# Altium schematic sheet Sheet_CL-PFC-01.SchDoc: PFC with DIODE
size A4; Author: Canaan Lv; DocumentNumber: CL-PFC-01; Revision: v1.1
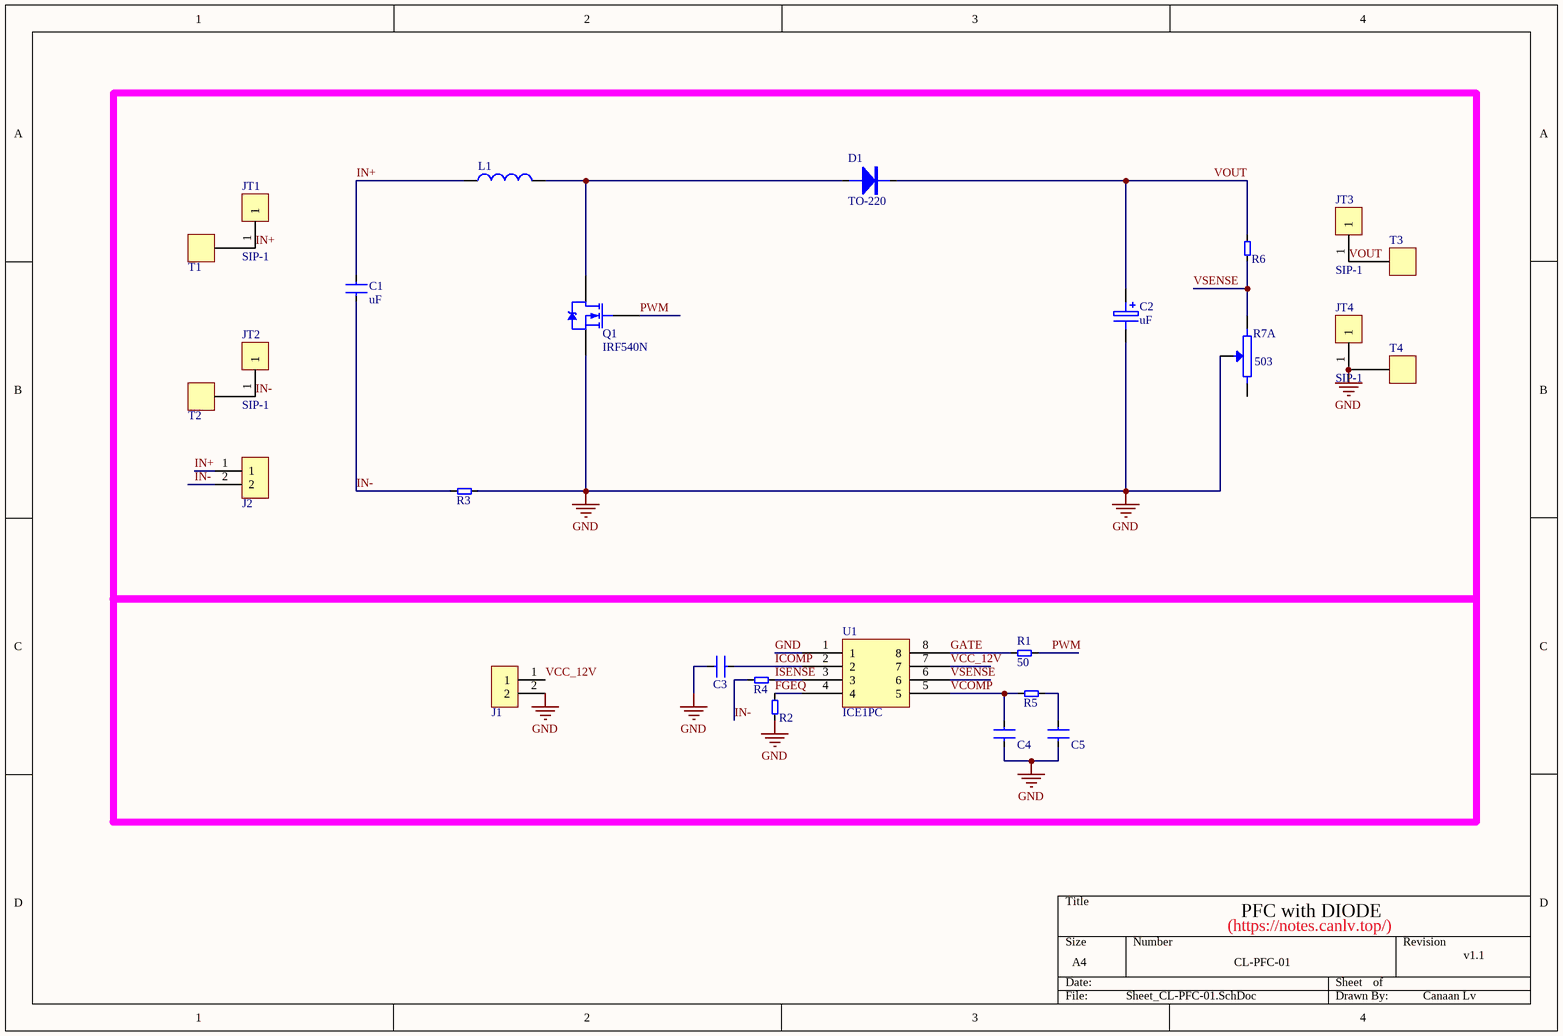
[diagram p0: Sheet_CL-PFC-01.SchDoc]

## Parts
C1  uF  [CAP-7.5-CP]
C2  uF  [CZ18X35]
C3  uF  [C120603]  (value not drawn)
C4  uF  [C120603]  (value not drawn)
C5  uF  [C120603]  (value not drawn)
D1  TO-220  [TO-220]
J1  SIP-2  [2.54XH接插件2P]  (value not drawn)
J2  SIP-2  [2.54XH接插件2P]  (value not drawn)
JT1  SIP-1  [2.54排针1X1]
JT2  SIP-1  [2.54排针1X1]
JT3  SIP-1  [2.54排针1X1]
JT4  SIP-1  [2.54排针1X1]
L1  (no value)  [77930]
Q1  IRF540N  [TO-220AB]
R1  R贴片电阻  [R120603]  (value not drawn)
R2  R贴片电阻  [R120603]  (value not drawn)
R3  R直插电阻  [水泥电阻]  (value not drawn)
R4  R贴片电阻  [R120603]  (value not drawn)
R5  R贴片电阻  [R120603]  (value not drawn)
R6  R贴片电阻  [R120603]  (value not drawn)
R7  (no value)  [ADJ-3296-1]  (part A of 2)
T1  香蕉头接线柱  [香蕉接线柱Black_6mm]  (value not drawn)
T2  香蕉头接线柱  [香蕉接线柱Black_6mm]  (value not drawn)
T3  香蕉头接线柱  [香蕉接线柱Black_6mm]  (value not drawn)
T4  香蕉头接线柱  [香蕉接线柱Black_6mm]  (value not drawn)
U1  ICE1PC  [SOP8]

## Nets
GND: C2.2 C3.1 C4.1 C5.1 J1.2 JT4.1 Q1.3(S) R2.1 R3.2 R7.2 T4.1 U1.1
FGEQ: R2.2 U1.4
GATE: R1.1 U1.8
ICOMP: C3.2 U1.2
IN+: C1.1 J2.1 JT1.1 L1.1 T1.1
IN-: C1.2 J2.2 JT2.1 R3.1 R4.2 T2.1
ISENSE: R4.1 U1.3
PWM: Q1.1(G) R1.2
VCC_12V: J1.1 U1.7
VCOMP: C4.2 R5.2 U1.5
VOUT: C2.1 D1.K JT3.1 R6.1 T3.1
VSENSE: R6.2 R7.1 U1.6
NetC5_2: C5.2 R5.1
NetD1_A: D1.A L1.2 Q1.2(D)

Not connected (* = marked no-connect by the designer): R7 3

## Notes on the sheet
- (https://notes.canlv.top/)
- (in symbol R电位器, part A) 503
- (in symbol R贴片电阻) 50

## Library data of the parts
C1 = C直插无极性
C2 = C直插电容
C3-C5 = C贴片电容
L1 = 直插电感
Q1 = IRF540N: HEXFET Power MOSFET; Note: Pin 2 is electrically connected to pin 4.; Sim Note: Thermal Model provided is not called on from main Subckt.; Published: 8-Jun-2000; LatestRevisionDate: 17-Jul-2002; LatestRevisionNote: Re-released for DXP Platform.; DatasheetVersion: May-1998; PackageVersion: Feb-1997; PackageReference: TO-220AB; Publisher: Altium Limited; PackageDescription: TO, Thru-Hole, Vertical, Heatsink Mounted; 3 In-Line Leads; Pitch 2.54 mm; ComponentLink1Description: Manufacturer Link; ComponentLink1URL: http://www.irf.com/; ComponentLink2Description: Datasheet; ComponentLink2URL: http://www.irf.com/product-info/datasheets/data/irf540n.pdf
R7 = R电位器
U1 = IC8